# EAGLE design V1 (EAGLE 7.4.0)
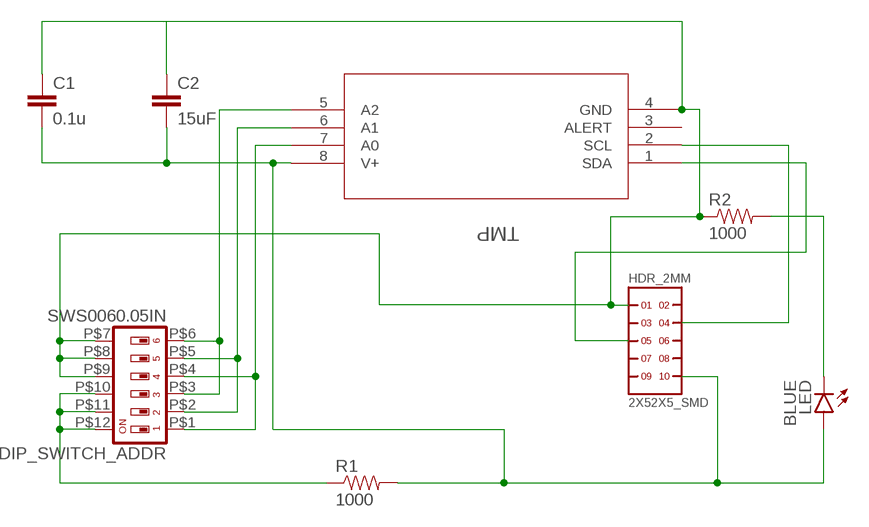
[diagram p0: schematic, sheet 1]

## Parts
C1  0.1u  22UF-6.3V-20%(0805)  [0805]
C2  15uF  1.0UF-25V-+80/-20(0805)"  [0805-CAP]
DIP_SWITCH_ADDR  SWS0060.05IN  [SMS-006]
HDR_2MM  2X52X5_SMD  [2X5]
LED  BLUE  LED-BLUE1206  [LED-1206]
R1  1000  RESISTOR0805-RES  [0805]
R2  1000  RESISTOR0805-RES  [0805]
TMP  TMP175_DGK_8  [DGK8]

## Nets
A1: DIP_SWITCH_ADDR.P$2 DIP_SWITCH_ADDR.P$5 TMP.6(A1)
A2: DIP_SWITCH_ADDR.P$3 DIP_SWITCH_ADDR.P$6 TMP.5(A2)
GND: C1.1 C2.1 DIP_SWITCH_ADDR.P$7 DIP_SWITCH_ADDR.P$8 DIP_SWITCH_ADDR.P$9 HDR_2MM.P$1 R2.1 TMP.4(GND)
N$1: C1.2 C2.2 HDR_2MM.P$10 LED.A R1.2 TMP.8(V+)
N$4: DIP_SWITCH_ADDR.P$10 DIP_SWITCH_ADDR.P$11 DIP_SWITCH_ADDR.P$12 R1.1
N$6: DIP_SWITCH_ADDR.P$1 DIP_SWITCH_ADDR.P$4 TMP.7(A0)
N$9: LED.C R2.2
SCL: HDR_2MM.P$4 TMP.2(SCL)
SDA: HDR_2MM.P$5 TMP.1(SDA)
Unconnected: HDR_2MM.P$2 HDR_2MM.P$3 HDR_2MM.P$6 HDR_2MM.P$7 HDR_2MM.P$8 HDR_2MM.P$9 TMP.3(ALERT)

## Library data of the parts
C1 = SparkFun-Capacitors:22UF-6.3V-20%(0805): CAP-08402 Ceramic; PROD_ID: CAP-08402; VALUE: 22uF
C2 = SparkFun-Capacitors:1.0UF-25V-+80/-20(0805): CAP-11625; PROD_ID: CAP-11625; VALUE: 1.0uF
DIP_SWITCH_ADDR = roshea:SWS006: SMD Dip Switch 6 pol.
HDR_2MM = headers(2mm)(samtec):2X5
LED = SparkFun-LED:LED-BLUE: Blue LEDs for production use Various blue LEDs stocked by SparkFun production 0603 - DIO-08575 Rebel - DIO-09553 1206 - DIO-09911; PROD_ID: DIO-09911
R1 R2 = SparkFun-Resistors:RESISTOR: Resistor Basic schematic elements and footprints for 0603, 1206, and PTH resistors.
TMP = EagleNew:TMP175_DGK_8; DATASHEETURL: http://www.ti.com/lit/gpn/TMP175; DESCRIPTION: Digital Temperature Sensor with 2-Wire Interface; FAMILY_NAME: TEMPERATURE SENSOR; GENERIC_PART_NUMBER: TMP175; INDUSTRY_STD_PKG_TYPE: MSOP; MANUFACTURER: Texas Instruments; MANUFACTURER_PART_NUMBER: tmp175_dgk_8; PACKAGE_DESIGNATOR: DGK; PIN_COUNT: 8; VENDOR: Texas Instruments

## Net classes
0 default: width 0.025 mm, drill 0.508 mm, clearance 0.254 mm

## Board
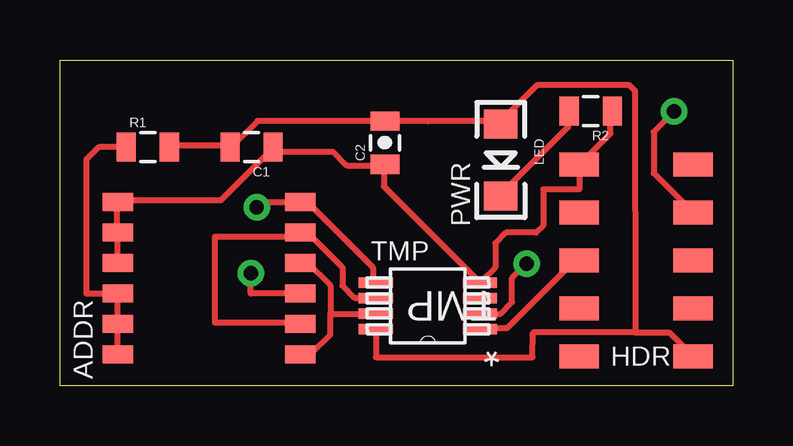
[diagram p1: board, top side]
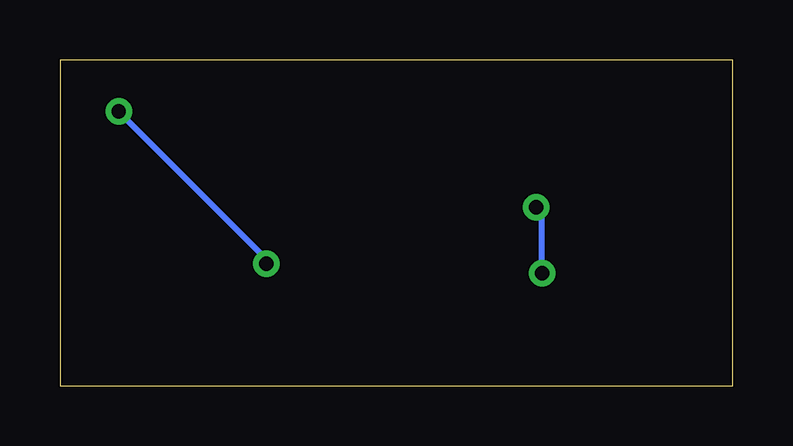
[diagram p2: board, bottom side, seen from below]

Size 28.05 x 13.6 mm. Coordinates in mm from the lower left corner, seen from the top.
Outline: 0,0 0,13.6 28.05,13.6 28.05,0 0,0
Copper layers (1*16): Top 0.035mm / dielectric 1.5mm / Bottom 0.035mm
Design rules "SparkFun": minimum track width 8mil, minimum drill 20mil, track to track 8mil, track to pad 8mil, pad to pad 8mil, via to via 8mil, smd to smd 8mil, copper to edge 8mil, drill to drill 8mil, minimum pad ring 12mil, minimum via ring 10mil, stop-mask expansion 4mil, vias tented up to drill 20mil, thermal gap 10mil

### Footprints (pad centres in the part's own frame; a part is rotated, then mirrored left to right if it is on the bottom)
0805 = smd 0.8 x 1.2: 1 -0.9,0; 2 0.9,0
0805-CAP = smd 0.8 x 1.2: 1 -0.9,0; 2 0.9,0
SMS-006 = smd 0.76 x 1.27: P$1 0.5,1; P$2 1.77,1; P$3 3.04,1; P$4 4.31,1; P$5 5.58,1; P$6 6.85,1; P$7 6.85,8.62; P$8 5.58,8.62; P$9 4.31,8.62; P$10 3.04,8.62; P$11 1.77,8.62; P$12 0.5,8.62
2X5 = smd 1 x 1.65: P$1 1,1.5; P$2 1,6.25; P$3 3,1.5; P$4 3,6.25; P$5 5,1.5; P$6 5,6.25; P$7 7,1.5; P$8 7,6.25; P$9 9,1.5; P$10 9,6.25
LED-1206 = smd 1.2 x 1.4: A -1.5,0; C 1.5,0
DGK8 = smd 1.422 x 0.432: 1 -2.172,0.975; 2 -2.172,0.325; 3 -2.172,-0.325; 4 -2.172,-0.975; 5 2.172,-0.975; 6 2.172,-0.325; 7 2.172,0.325; 8 2.172,0.975

### Placement (x,y rotation side)
C1  7.99,9.96 180 top
C2  13.55,10.15 90 top
DIP_SWITCH_ADDR  11.03,0.82 90 top
HDR_2MM  20.15,10.23 270 top
LED  18.38,9.42 270 top
R1  3.66,9.96 0 top
R2  22.13,11.47 180 top
TMP  15.34,3.34 180 top

### Tracks (layer width: path | path; a pad name or v marks a point on that pad's centre or on a via)
A1
  Top 0.254: DIP_SWITCH_ADDR.P$2 10,2.66 6.46,2.66 6.45,2.65 6.45,6.22 10,6.22 DIP_SWITCH_ADDR.P$5 10.26,6.47 11.78,4.95 11.78,4.19 12.29,3.68 13.05,3.68 TMP.6
A2  (via drill 0.6)
  Top 0.254: TMP.5 13.05,4.44 13.05,4.95 10.26,7.74 DIP_SWITCH_ADDR.P$6 8.42,7.67 v8.2,7.45 | DIP_SWITCH_ADDR.P$3 7.95,3.86 v7.95,4.7
  Bottom 0.254: v7.95,4.7 7.95,7.2 v8.2,7.45
GND
  Top 0.254: R2.1 22.96,11.3 22.96,10.54 HDR_2MM.P$1 21.65,8.2 20.15,8.2 20.15,6.7 19.85,6.4 18.6,6.4 18.15,5.95 18.15,4.95 TMP.4 | DIP_SWITCH_ADDR.P$9 2.38,5.2 2.38,6.22 DIP_SWITCH_ADDR.P$8 2.38,6.47 2.38,7.49 DIP_SWITCH_ADDR.P$7 2.64,7.74 6.7,7.74 8.73,9.77 C1.1 8.99,9.77 11.38,9.77 11.95,9.2 13.5,9.2 | 17.37,4.44 TMP.4 | 17.85,4.3 17.6,4.3 TMP.4 | TMP.4 13.5,8.33 13.5,9.2 | 13.5,9.2 C2.1
N$1
  Top 0.254: 24,2.23 19.73,2.23 19.7,1.2 13.17,1.2 TMP.8 | 26.26,1.39 HDR_2MM.P$10 25.4,2.23 24,2.23 | R1.2 4.67,10.03 6.95,10.03 C1.2 7.21,10.03 8.23,11.05 C2.2 15.36,11.04 18.13,11.04 LED.A 18.38,11.04 19.91,12.57 23.72,12.57 23.97,12.31 24,2.23
N$4
  Top 0.254: DIP_SWITCH_ADDR.P$12 2.38,1.39 2.38,2.41 DIP_SWITCH_ADDR.P$11 2.38,2.66 2.38,3.68 DIP_SWITCH_ADDR.P$10 1.1,3.86 1.1,9.45 1.61,9.96 R1.1
N$6
  Top 0.254: 11.27,3.02 11.27,4.19 10.26,5.2 DIP_SWITCH_ADDR.P$4 | DIP_SWITCH_ADDR.P$1 10.26,1.39 10.51,1.39 11.27,2.15 11.27,3.02 | 11.27,3.02 TMP.7
N$9
  Top 0.254: R2.2 21.18,11.3 21.18,10.79 18.38,8 LED.C
SCL  (via drill 0.6)
  Top 0.254: TMP.2 18.36,3.02 18.85,3.5 18.85,4.5 v19.45,5.1 | v25.6,11.45 24.75,10.6 24.75,8.88 HDR_2MM.P$4
  Bottom 0.254: v19.45,5.1 19.45,5.3 v25.6,11.45
SDA
  Top 0.254: TMP.1 17.62,2.41 18.64,2.41 21.43,5.2 HDR_2MM.P$5

### Text on the board
tSilk: PWR | TMP | ADDR | HDR